# Altium schematic sheet ESD.SchDoc: ESD Protection
size A4 portrait; Date: 08.04.2017; CheckedBy: CheckedBy; Author: Jan Petrik; CompanyName: FreeDSP; DrawnBy: Jan Petrik; Organization: FreeDSP; DocumentNumber: 16; Revision: B2; SheetNumber: 16; SheetTotal: 16; Version1: N/A; Version2: N/A; Version3: N/A; Change1description: N/A; Change2description: N/A; Change3description: N/A; Change1DrawnBy: N/A; Change2DrawnBy: N/A; Change3DrawnBy: N/A; Change1CheckedBy: N/A; Change2CheckedBy: N/A; Change3CheckedBy: N/A; PreviusVersion_Chng1: N/A; PreviusVersion_Chng2: N/A; PreviusVersion_Chng3: N/A; Variant1description: Standard assembly; Variant2description: N/A; Variant3description: N/A; Variant4description: N/A; PageSetup: Record=PageOptions|CenterHorizontal=True|CenterVertical=True|PrintScale=0.97|XCorrection=1.00|YCorrection=1.00|PrintKind=2|BorderSize=5000000|LeftOffset=0|BottomOffset=0|Orientation=2|PaperLength=1000|PaperWidth=1000|Scale=100|PaperSource=7|PrintQuality=-3|MediaType=1|DitherType=10|PrintScaleMode=1|PaperKind=A4|PaperIndex=9; drawing number: blablabla; email: jan_petrik@centrum.cz; license: CC BY-NC 4.0; DocumentName: Docname
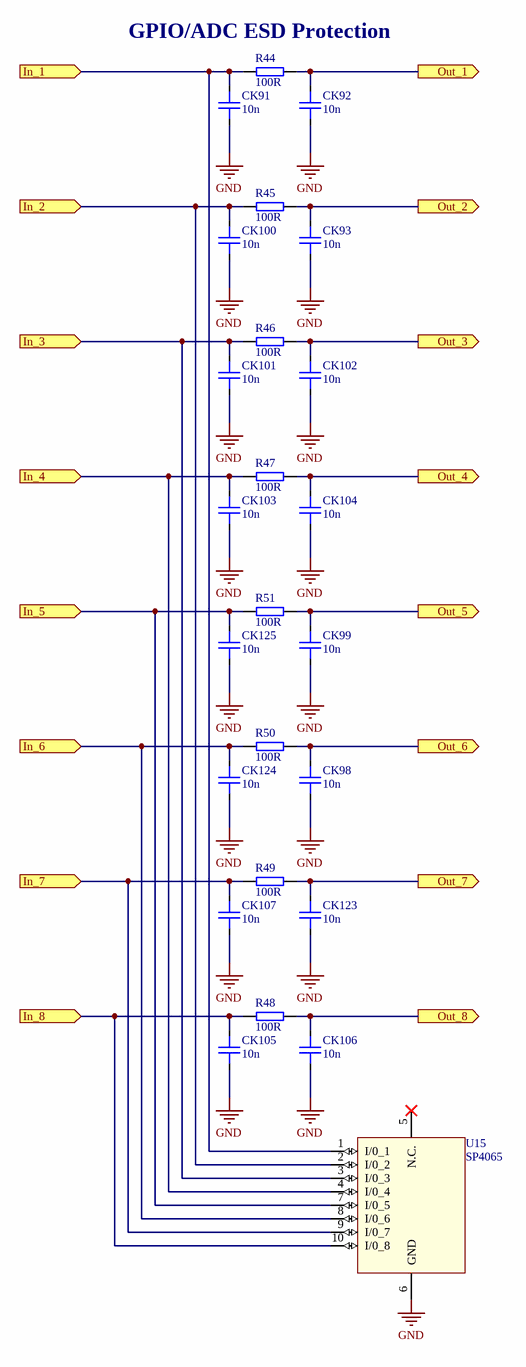
[diagram p0: ESD.SchDoc]

## Parts
CK91  10n  [CAPC1608X09N(SMC0603)]
CK92  10n  [CAPC1608X09N(SMC0603)]
CK93  10n  [CAPC1608X09N(SMC0603)]
CK98  10n  [CAPC1608X09N(SMC0603)]
CK99  10n  [CAPC1608X09N(SMC0603)]
CK100  10n  [CAPC1608X09N(SMC0603)]
CK101  10n  [CAPC1608X09N(SMC0603)]
CK102  10n  [CAPC1608X09N(SMC0603)]
CK103  10n  [CAPC1608X09N(SMC0603)]
CK104  10n  [CAPC1608X09N(SMC0603)]
CK105  10n  [CAPC1608X09N(SMC0603)]
CK106  10n  [CAPC1608X09N(SMC0603)]
CK107  10n  [CAPC1608X09N(SMC0603)]
CK123  10n  [CAPC1608X09N(SMC0603)]
CK124  10n  [CAPC1608X09N(SMC0603)]
CK125  10n  [CAPC1608X09N(SMC0603)]
R44  100R  [RESC1608X06N(SMR0603)]
R45  100R  [RESC1608X06N(SMR0603)]
R46  100R  [RESC1608X06N(SMR0603)]
R47  100R  [RESC1608X06N(SMR0603)]
R48  100R  [RESC1608X06N(SMR0603)]
R49  100R  [RESC1608X06N(SMR0603)]
R50  100R  [RESC1608X06N(SMR0603)]
R51  100R  [RESC1608X06N(SMR0603)]
U15  SP4065  [TSSOP50P490X110-10N(MSOP10)]

## Ports
In_1 (in), In_2 (in), In_3 (in), In_4 (in), In_5 (in), In_6 (in), In_7 (in), In_8 (in), Out_1 (out), Out_2 (out), Out_3 (out), Out_4 (out), Out_5 (out), Out_6 (out), Out_7 (out), Out_8 (out)

## Nets
GND: CK91.2 CK92.2 CK93.2 CK98.2 CK99.2 CK100.2 CK101.2 CK102.2 CK103.2 CK104.2 CK105.2 CK106.2 CK107.2 CK123.2 CK124.2 CK125.2 U15.6(GND)
In_1: CK91.1 R44.1 U15.1(I/0_1) ; port In_1
In_2: CK100.1 R45.1 U15.2(I/0_2) ; port In_2
In_3: CK101.1 R46.1 U15.3(I/0_3) ; port In_3
In_4: CK103.1 R47.1 U15.4(I/0_4) ; port In_4
In_5: CK125.1 R51.1 U15.7(I/0_5) ; port In_5
In_6: CK124.1 R50.1 U15.8(I/0_6) ; port In_6
In_7: CK107.1 R49.1 U15.9(I/0_7) ; port In_7
In_8: CK105.1 R48.1 U15.10(I/0_8) ; port In_8
Out_1: CK92.1 R44.2 ; port Out_1
Out_2: CK93.1 R45.2 ; port Out_2
Out_3: CK102.1 R46.2 ; port Out_3
Out_4: CK104.1 R47.2 ; port Out_4
Out_5: CK99.1 R51.2 ; port Out_5
Out_6: CK98.1 R50.2 ; port Out_6
Out_7: CK123.1 R49.2 ; port Out_7
Out_8: CK106.1 R48.2 ; port Out_8

Not connected (* = marked no-connect by the designer): U15 5(N.C.)*

## Notes on the sheet
- (near R44) GPIO/ADC ESD Protection
- Designed by:
- Sheet Title:
- Board Revision:
- License:
- Email:
- www.freedsp.cc
- www.pidsp.com
- Date:
- Sheet:
- /

## Library data of the parts
CK91-CK93 CK98-CK107 CK123-CK125 = 10n-50V-0603-X7R: MLCC; Signal Integrity: Cap; Tolerance: 10%; Voltage: 50V; Value: 10n; Package: SMC0603; Simulation: Cap; Author: JP/27.03.2014; Supplier 1: Mouser; Supplier Part Number 1: 81-GRM39X103K50D
R44-R51 = 100R-100mW-0603-ThickFilm: Chip Resistor; Tolerance & Rating: 1%/0.1W; Signal Integrity: Res; Packare: SMR0603; Value: 100R; Simulation: Res; Author: JP/10.06.2014; SMD: 1; Supplier 1: Mouser; Supplier Part Number 1: 603-RC0603FR-07100RL; Type: Resistor
U15 = SP4065: 3.3V 20A  Diode  ESD Array; SMD: 1; Supplier 1: Mouser; Value: SP4065; Supplier Part Number 1: 576-SP4065-08ATG